# EAGLE design InterfaceTVSBoardRevB (EAGLE 7.5.0)
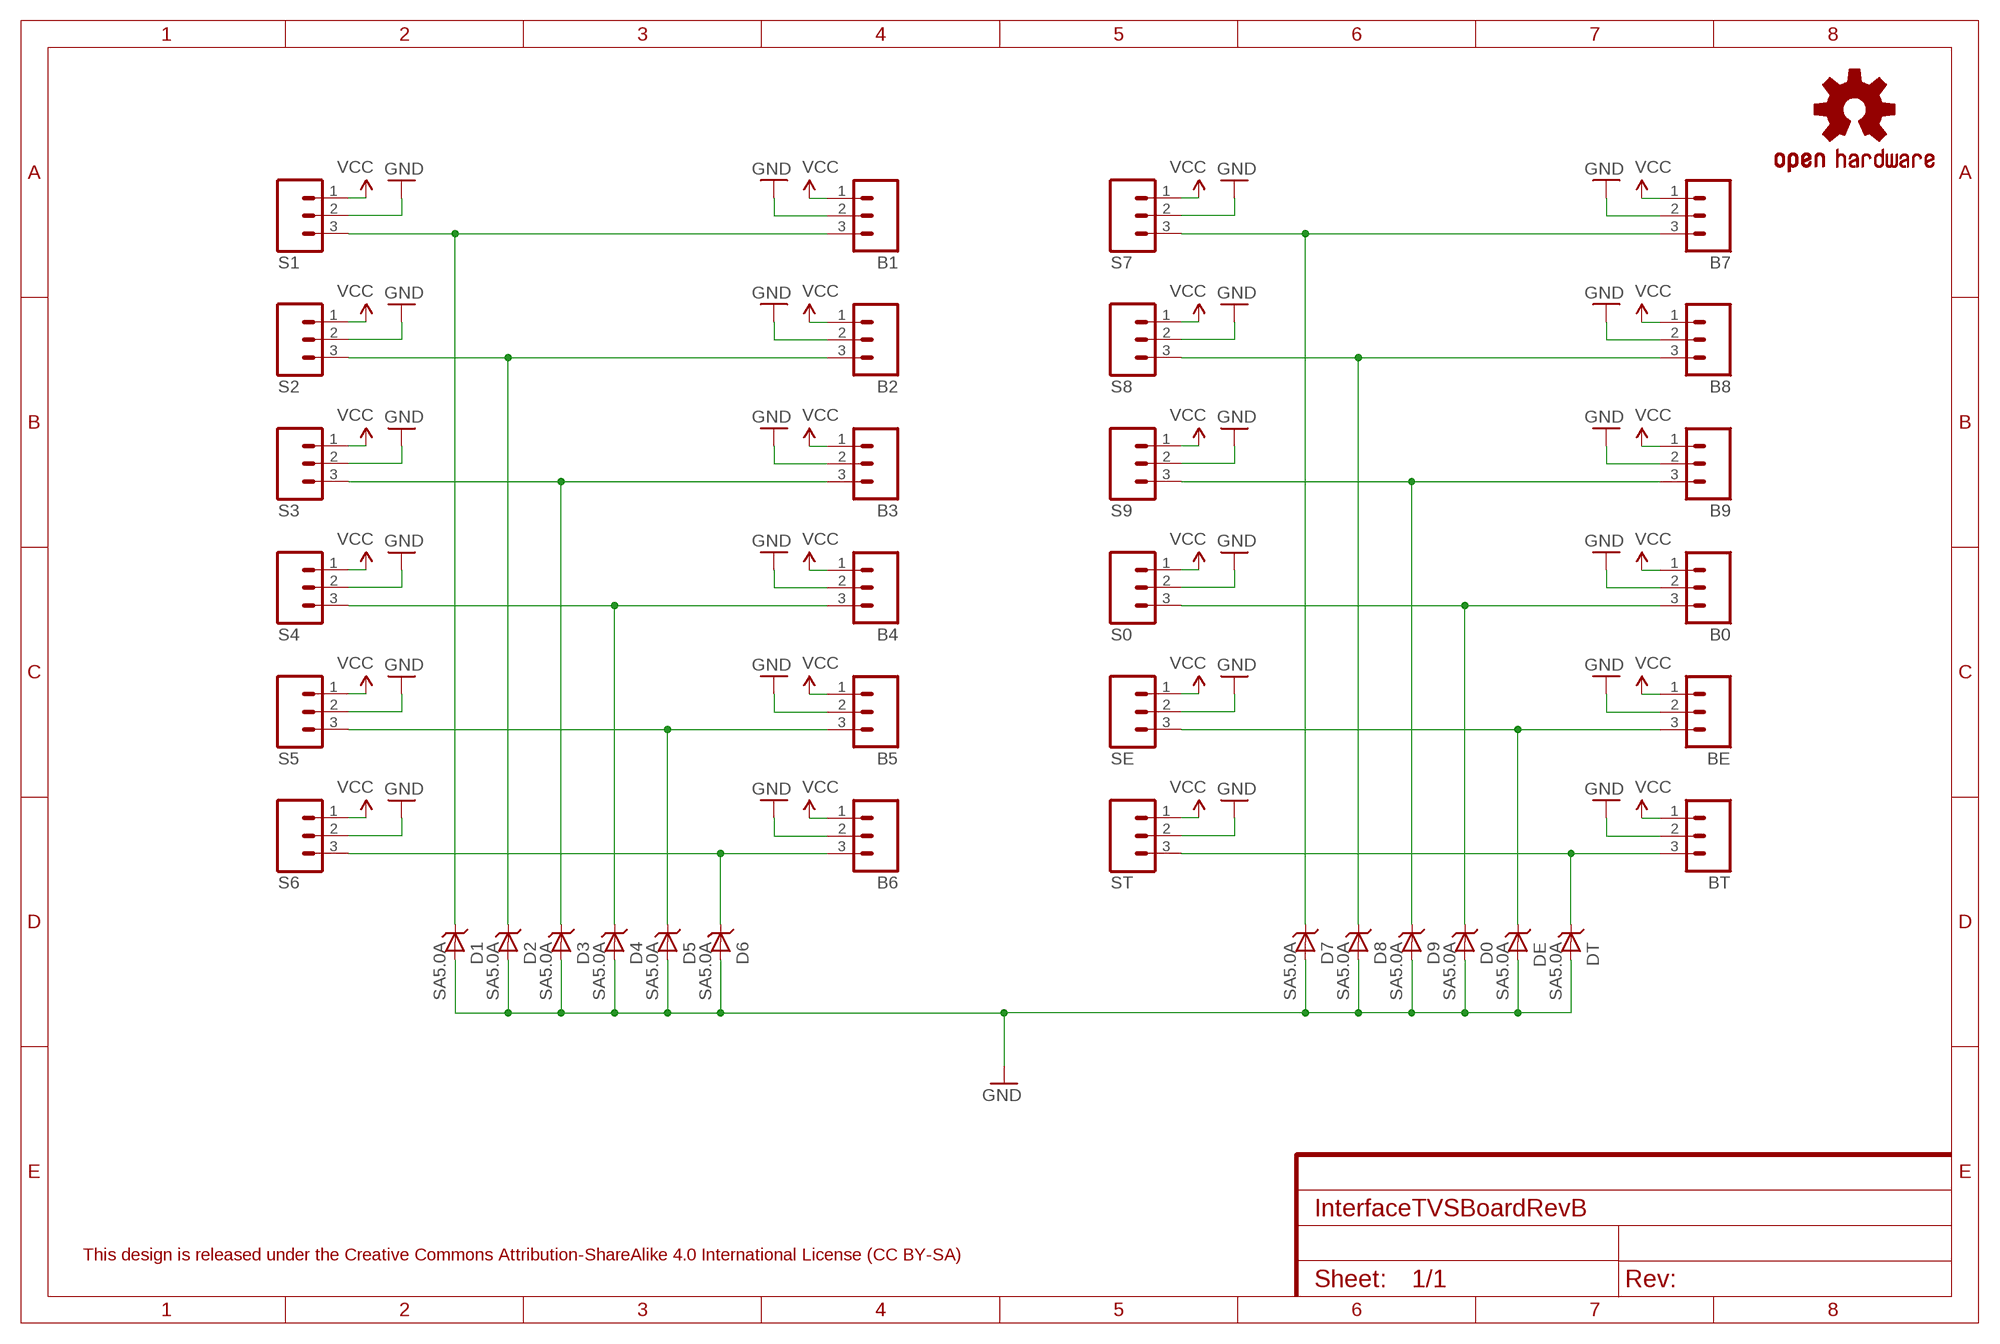
[diagram p0: schematic, sheet 1]
FRAME1 (FRAME-A4L): CNAME: Simulator Interface TVS Board; CREVISION: B 08/2016; DESIGNER: A J Instone-Cowie

## Parts
B0  M03PTH  [1X03]
B1  M03PTH  [1X03]
B2  M03PTH  [1X03]
B3  M03PTH  [1X03]
B4  M03PTH  [1X03]
B5  M03PTH  [1X03]
B6  M03PTH  [1X03]
B7  M03PTH  [1X03]
B8  M03PTH  [1X03]
B9  M03PTH  [1X03]
BE  M03PTH  [1X03]
BT  M03PTH  [1X03]
D0  SA5.0A  [DO41_TVS_UNI]
D1  SA5.0A  [DO41_TVS_UNI]
D2  SA5.0A  [DO41_TVS_UNI]
D3  SA5.0A  [DO41_TVS_UNI]
D4  SA5.0A  [DO41_TVS_UNI]
D5  SA5.0A  [DO41_TVS_UNI]
D6  SA5.0A  [DO41_TVS_UNI]
D7  SA5.0A  [DO41_TVS_UNI]
D8  SA5.0A  [DO41_TVS_UNI]
D9  SA5.0A  [DO41_TVS_UNI]
DE  SA5.0A  [DO41_TVS_UNI]
DT  SA5.0A  [DO41_TVS_UNI]
LOGO1  OSHW-LOGOS  [OSHW-LOGO-S]
S0  M03PTH  [1X03]
S1  M03PTH  [1X03]
S2  M03PTH  [1X03]
S3  M03PTH  [1X03]
S4  M03PTH  [1X03]
S5  M03PTH  [1X03]
S6  M03PTH  [1X03]
S7  M03PTH  [1X03]
S8  M03PTH  [1X03]
S9  M03PTH  [1X03]
SE  M03PTH  [1X03]
ST  M03PTH  [1X03]

## Nets
GND: B0.2 B1.2 B2.2 B3.2 B4.2 B5.2 B6.2 B7.2 B8.2 B9.2 BE.2 BT.2 D0.ANODE D1.ANODE D2.ANODE D3.ANODE D4.ANODE D5.ANODE D6.ANODE D7.ANODE D8.ANODE D9.ANODE DE.ANODE DT.ANODE S0.2 S1.2 S2.2 S3.2 S4.2 S5.2 S6.2 S7.2 S8.2 S9.2 SE.2 ST.2
N$1: B1.3 D1.CATHODE S1.3
N$2: B2.3 D2.CATHODE S2.3
N$3: B3.3 D3.CATHODE S3.3
N$4: B4.3 D4.CATHODE S4.3
N$5: B5.3 D5.CATHODE S5.3
N$6: B6.3 D6.CATHODE S6.3
N$7: B7.3 D7.CATHODE S7.3
N$8: B8.3 D8.CATHODE S8.3
N$9: B9.3 D9.CATHODE S9.3
N$10: B0.3 D0.CATHODE S0.3
N$11: BE.3 DE.CATHODE SE.3
N$12: BT.3 DT.CATHODE ST.3
VCC: B0.1 B1.1 B2.1 B3.1 B4.1 B5.1 B6.1 B7.1 B8.1 B9.1 BE.1 BT.1 S0.1 S1.1 S2.1 S3.1 S4.1 S5.1 S6.1 S7.1 S8.1 S9.1 SE.1 ST.1

## Notes on the sheet
- This design is released under the Creative Commons Attribution-ShareAlike 4.0 International License (CC BY-SA)

## Library data of the parts
B0 B1-B9 BE BT S0 S1-S9 SE ST = SparkFun-Connectors:M03: Header 3 Standard 3-pin 0.1" header. Use with straight break away headers (SKU : PRT-00116), right angle break away headers (PRT-00553), swiss pins (PRT-00743), machine pins (PRT-00117), and female headers (PRT-00115). Molex polarized connector foot print use with SKU : PRT-08232 with associated crimp pins and housings.
D0 D1-D9 DE DT = AIC_Custom:SA5.0A: SA5.0CA TVS Uni-Directional Transient Voltage Suppressor. 5V, DO41 package
LOGO1 = SparkFun-Aesthetics:OSHW-LOGO: Open Source Hardware Logo This logo indicates the piece of hardware it is found on incorporates a OSHW license and/or adheres to the definition of open source hardware found here: http://freedomdefined.org/OSHW

## Board
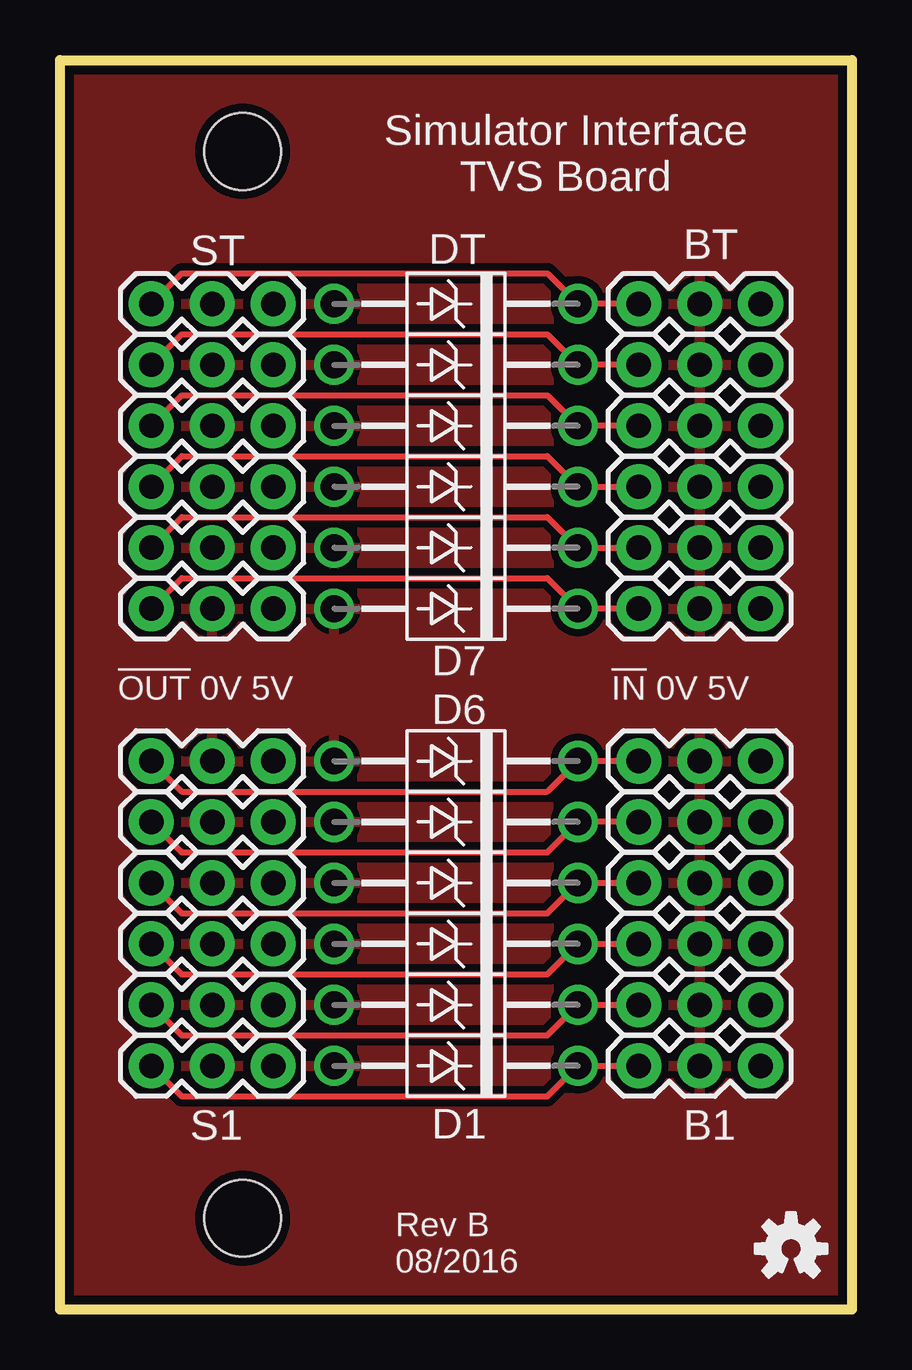
[diagram p1: board, top side]
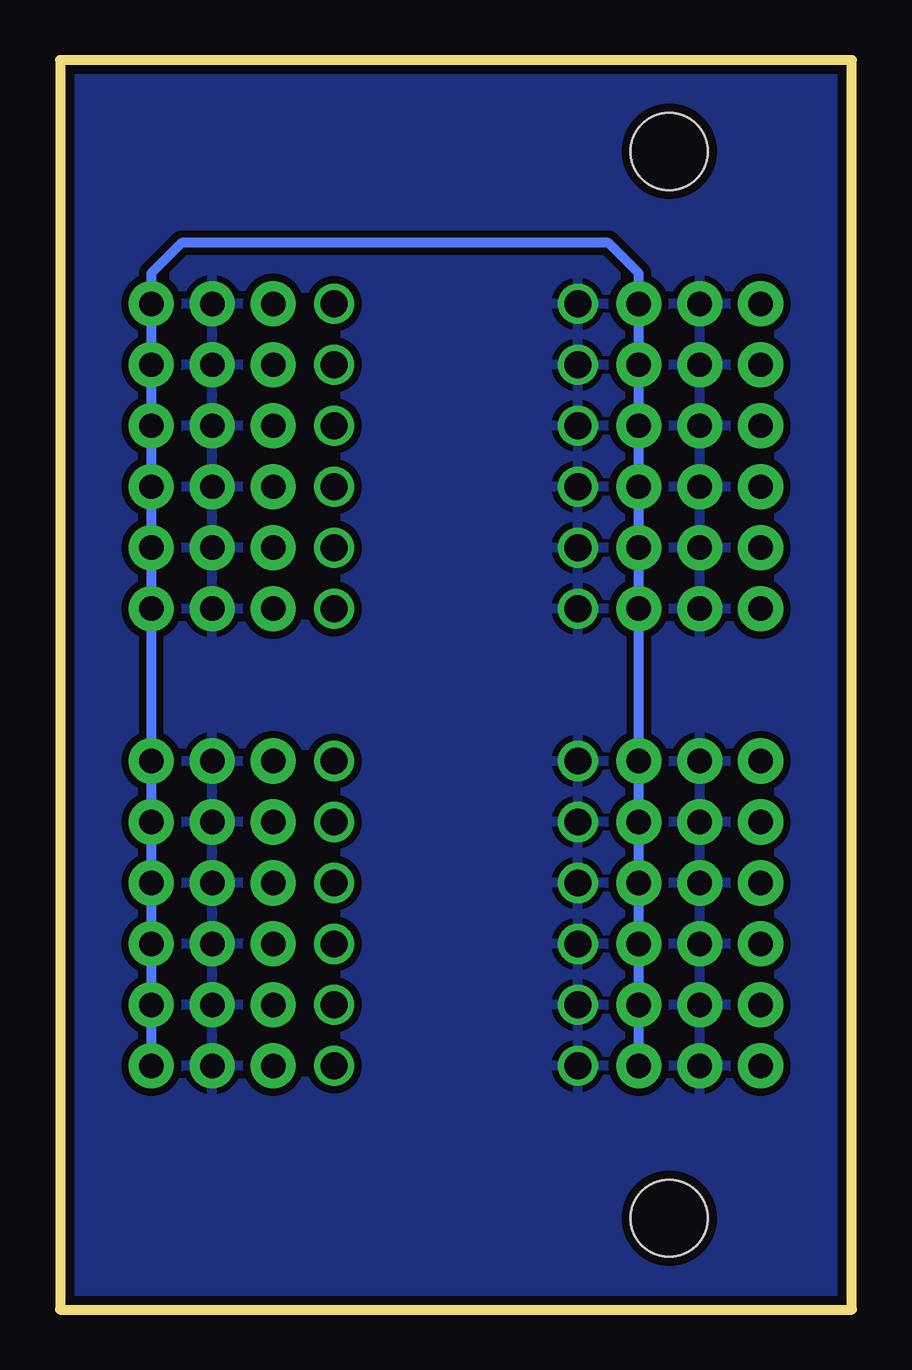
[diagram p2: board, bottom side, seen from below]

Size 33.02 x 52.07 mm. Coordinates in mm from the lower left corner, seen from the top.
Outline: 0,52.07 33.02,52.07 33.02,0 0,0 0,52.07
Copper layers (1*16): Top 0.0356mm / dielectric 1.5011mm / Bottom 0.0356mm
Design rules "LaenPCBOrder(OSHPARK)": minimum track width 6mil, minimum drill 13mil, track to track 6mil, track to pad 6mil, pad to pad 6mil, via to via 6mil, smd to smd 6mil, copper to edge 15mil, drill to drill 6mil, minimum pad ring 7mil, minimum via ring 7mil, stop-mask expansion 3mil, vias tented up to drill 0mil, thermal gap 10mil
Holes 3.2 mm at 7.62,3.81 7.62,48.26

### Footprints (pad centres in the part's own frame; a part is rotated, then mirrored left to right if it is on the bottom)
1X03 = drill 1.016 pad 1.88: 1 0,0; 2 2.54,0; 3 5.08,0
DO41_TVS_UNI = drill 1.118: ANODE -5.08,0; CATHODE 5.08,0

### Placement (x,y rotation side)
B0  29.21,36.83 180 top
B1  29.21,10.16 180 top
B2  29.21,12.7 180 top
B3  29.21,15.24 180 top
B4  29.21,17.78 180 top
B5  29.21,20.32 180 top
B6  29.21,22.86 180 top
B7  29.21,29.21 180 top
B8  29.21,31.75 180 top
B9  29.21,34.29 180 top
BE  29.21,39.37 180 top
BT  29.21,41.91 180 top
D0  16.51,36.83 0 top
D1  16.51,10.16 0 top
D2  16.51,12.7 0 top
D3  16.51,15.24 0 top
D4  16.51,17.78 0 top
D5  16.51,20.32 0 top
D6  16.51,22.86 0 top
D7  16.51,29.21 0 top
D8  16.51,31.75 0 top
D9  16.51,34.29 0 top
DE  16.51,39.37 0 top
DT  16.51,41.91 0 top
LOGO1  30.48,2.54 0 top
S0  8.89,36.83 180 top
S1  8.89,10.16 180 top
S2  8.89,12.7 180 top
S3  8.89,15.24 180 top
S4  8.89,17.78 180 top
S5  8.89,20.32 180 top
S6  8.89,22.86 180 top
S7  8.89,29.21 180 top
S8  8.89,31.75 180 top
S9  8.89,34.29 180 top
SE  8.89,39.37 180 top
ST  8.89,41.91 180 top

### Tracks (layer width: path | path; a pad name or v marks a point on that pad's centre or on a via)
GND
  pour Bottom (isolate 0.305): 0,52.07 0,0 33.02,0 33.02,52.07
  pour Top (isolate 0.305): 0,52.07 0,0 33.02,0 33.02,52.07
N$1
  Top 0.254: S1.3 5.08,8.89 20.32,8.89 D1.CATHODE B1.3
N$2
  Top 0.254: B2.3 D2.CATHODE 20.32,11.43 5.08,11.43 S2.3
N$3
  Top 0.254: S3.3 5.08,13.97 20.32,13.97 D3.CATHODE B3.3
N$4
  Top 0.254: S4.3 5.08,16.51 20.32,16.51 D4.CATHODE B4.3
N$5
  Top 0.254: S5.3 5.08,19.05 20.32,19.05 D5.CATHODE B5.3
N$6
  Top 0.254: S6.3 5.08,21.59 20.32,21.59 D6.CATHODE B6.3
N$7
  Top 0.152: 21.69,29.26 D7.CATHODE
  Top 0.254: S7.3 5.08,30.48 20.32,30.48 D7.CATHODE B7.3
N$8
  Top 0.254: S8.3 5.08,33.02 20.32,33.02 D8.CATHODE B8.3
N$9
  Top 0.152: 21.54,34.29 D9.CATHODE
  Top 0.254: S9.3 5.08,35.56 20.32,35.56 D9.CATHODE B9.3
N$10
  Top 0.152: 21.69,36.88 D0.CATHODE
  Top 0.254: S0.3 5.08,38.1 20.32,38.1 D0.CATHODE B0.3
N$11
  Top 0.152: 21.69,39.32 DE.CATHODE
  Top 0.254: SE.3 5.08,40.64 20.32,40.64 DE.CATHODE BE.3
N$12
  Top 0.152: 21.54,41.91 DT.CATHODE
  Top 0.254: ST.3 5.08,43.18 20.32,43.18 DT.CATHODE BT.3
VCC
  Bottom 0.406: S1.1 S2.1 S3.1 S4.1 S5.1 S6.1 S7.1 S8.1 S9.1 S0.1 SE.1 ST.1 8.89,43.18 10.16,44.45 27.94,44.45 29.21,43.18 BT.1 BE.1 B0.1 B9.1 B8.1 B7.1 B6.1 B5.1 B4.1 B3.1 B2.1 B1.1

### Text on the board
tPlace: Simulator Interface / TVS Board | !OUT! 0V 5V | !IN! 0V 5V | Rev B / 08/2016